# Altium schematic sheet etapa1.SchDoc
size A
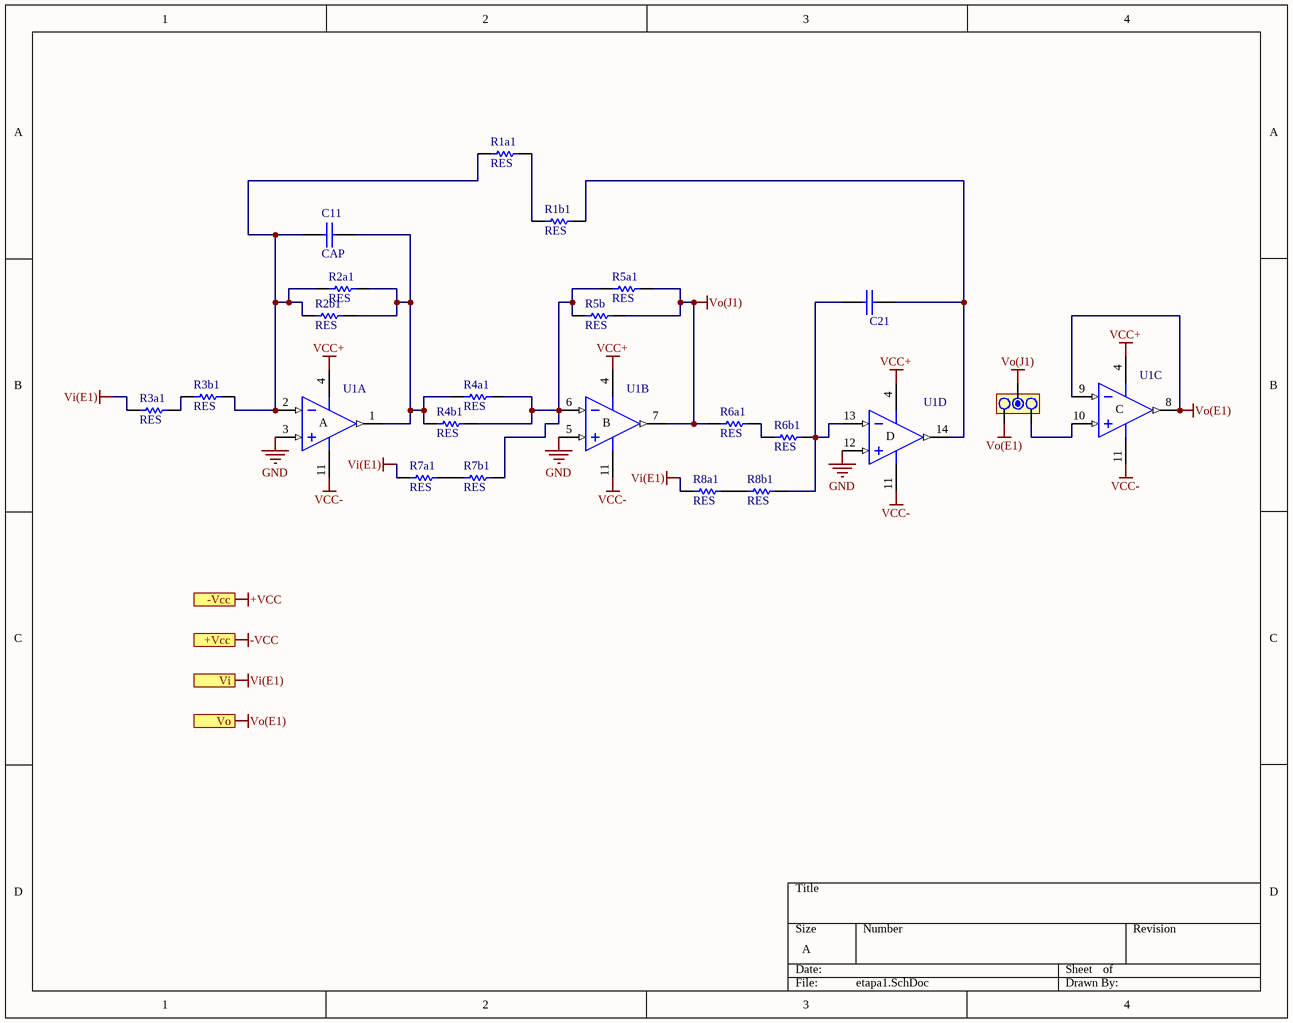
[diagram p0: etapa1.SchDoc]

## Parts
C11  CAP  [CAP200]
C21  CAP  [CAP200]  (value not drawn)
Jumper1  JUMPER  [JUMPER3]  (value not drawn)
R1a1  RES  [0805]
R1b1  RES  [0805]
R2a1  RES  [0805]
R2b1  RES  [0805]
R3a1  RES  [0805]
R3b1  RES  [0805]
R4a1  RES  [0805]
R4b1  RES  [0805]
R5a1  RES  [0805]
R5b  RES  [0805]
R6a1  RES  [0805]
R6b1  RES  [0805]
R7a1  RES  [0805]
R7b1  RES  [0805]
R8a1  RES  [0805]
R8b1  RES  [0805]
U1  TL084N  [N014]  (value not drawn)  (parts A,B,C,D of 4)

## Ports
+Vcc, -Vcc, Vi, Vo

## Nets
+VCC: port -Vcc
-VCC: port +Vcc
GND: U1.3(IN+) U1.5(IN+) U1.12(IN+)
VCC+: U1.4(V+)
VCC-: U1.11(V-)
Vi(E1): R3a1.1 R7a1.1 R8a1.1 ; port Vi
Vo(E1): Jumper1.3 U1.8(OUT) U1.9(IN-) ; port Vo
Vo(J1): Jumper1.2 R5a1.2 R5b.2 R6a1.1 U1.7(OUT)
NetC11_1: C11.1 R1a1.1 R2a1.1 R2b1.1 R3b1.2 U1.2(IN-)
NetC11_2: C11.2 R2a1.2 R2b1.2 R4a1.1 R4b1.1 U1.1(OUT)
NetC21_1: C21.1 R6b1.2 R8b1.2 U1.13(IN-)
NetC21_2: C21.2 R1b1.2 U1.14(OUT)
NetJumper1_1: Jumper1.1 U1.10(IN+)
NetR1a1_2: R1a1.2 R1b1.1
NetR3a1_2: R3a1.2 R3b1.1
NetR4a1_2: R4a1.2 R4b1.2 R5a1.1 R5b.1 R7b1.2 U1.6(IN-)
NetR6a1_2: R6a1.2 R6b1.1
NetR7a1_2: R7a1.2 R7b1.1
NetR8a1_2: R8a1.2 R8b1.1

## Notes on the sheet
- (in symbol TL084N, part A) A
- (in symbol TL084N, part B) B
- (in symbol TL084N, part C) C
- (in symbol TL084N, part D) D

## Library data of the parts
Jumper1 = JUMPER3
U1 = TL084N: JFET-Input Operational Amplifier; Published: 16-Jan-2001; LatestRevisionDate: 04-Mar-2005; LatestRevisionNote: Stylized 3D Model Added.; DatasheetVersion: Feb-1999; PackageVersion: Oct-1995; PackageReference: N014; Publisher: Altium Limited; PackageDescription: DIP; 14 Leads; Row Spacing 7.62 mm; Pitch 2.54 mm; ComponentLink1Description: Manufacturer Link; ComponentLink1URL: http://www.ti.com/; ComponentLink2Description: Datasheet; ComponentLink2URL: http://www-s.ti.com/sc/ds/tl084.pdf